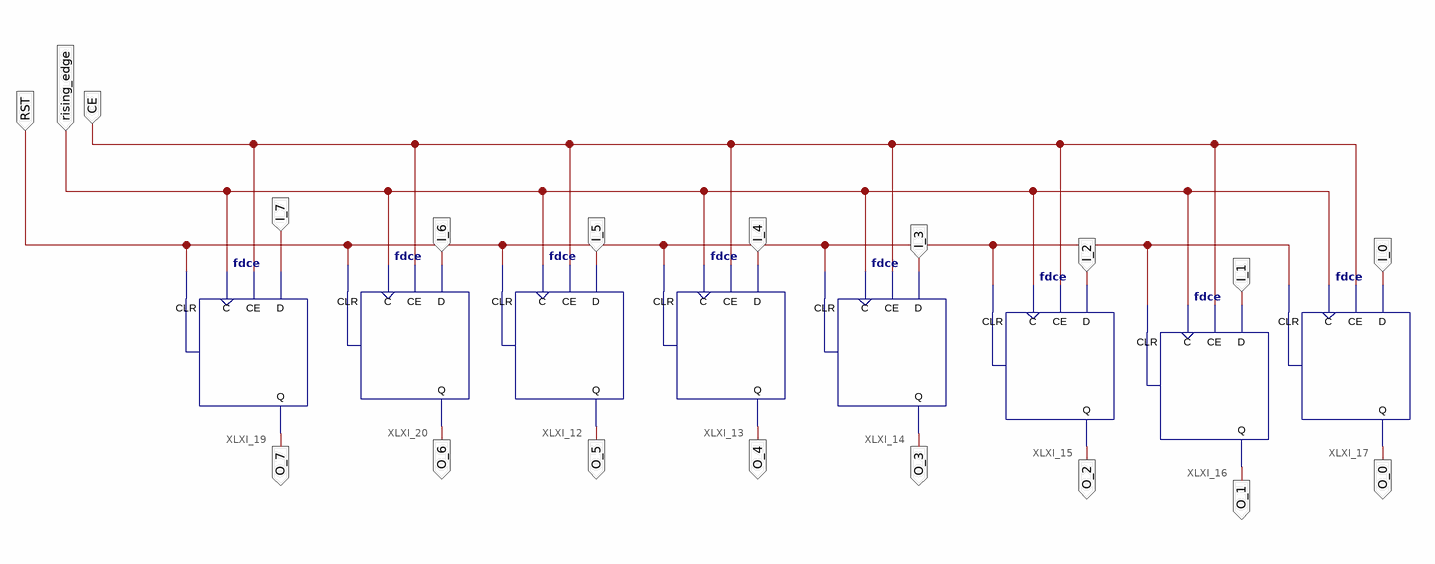
[diagram p0: schematic sheet 1]
// Xilinx ISE schematic outputreg_at_end_ofinput.sch (spartan3e) as structural Verilog: 8 symbols, 19 ports
module outputreg_at_end_ofinput (
  input  rising_edge,
  input  RST,
  input  CE,
  input  I_4,
  input  I_1,
  input  I_0,
  input  I_2,
  input  I_3,
  input  I_5,
  input  I_6,
  input  I_7,
  output O_4,
  output O_0,
  output O_1,
  output O_2,
  output O_3,
  output O_5,
  output O_6,
  output O_7
);

  fdce XLXI_17 (.C(rising_edge), .CE(CE), .CLR(RST), .D(I_0), .Q(O_0));
  fdce XLXI_16 (.C(rising_edge), .CE(CE), .CLR(RST), .D(I_1), .Q(O_1));
  fdce XLXI_15 (.C(rising_edge), .CE(CE), .CLR(RST), .D(I_2), .Q(O_2));
  fdce XLXI_14 (.C(rising_edge), .CE(CE), .CLR(RST), .D(I_3), .Q(O_3));
  fdce XLXI_13 (.C(rising_edge), .CE(CE), .CLR(RST), .D(I_4), .Q(O_4));
  fdce XLXI_12 (.C(rising_edge), .CE(CE), .CLR(RST), .D(I_5), .Q(O_5));
  fdce XLXI_20 (.C(rising_edge), .CE(CE), .CLR(RST), .D(I_6), .Q(O_6));
  fdce XLXI_19 (.C(rising_edge), .CE(CE), .CLR(RST), .D(I_7), .Q(O_7));
endmodule
